# Altium schematic sheet PSU3.SchDoc: PCB-Tester PSU3
size A4; Date: JUN 2020; CheckedBy: Moerz, Hoeren; Author: Rudziński; CompanyName: TDK-Micronas GmbH; DrawnBy: Rudziński; Engineer: Rudziński; Organization: Test Engineering; Address1: Hans-Bunte-Strasse 19; Address2: D-79108 Freiburg; Address3: Germany; DocumentNumber: U33110; Revision: V1.0; SheetNumber: 17; SheetTotal: 20; DateDraw: JUN 2020; DateChecked: 2020-06-19; Workspace: Workspace; TitleTyp: Title-Typ; PageSetup: Record=PageOptions|CenterHorizontal=True|CenterVertical=True|PrintScale=0.97|XCorrection=1.00|YCorrection=1.00|PrintKind=0|BorderSize=5000000|LeftOffset=0|BottomOffset=0|Orientation=2|PaperLength=1000|PaperWidth=1000|Scale=100|PaperSource=7|PrintQuality=-3|MediaType=1|DitherType=10|PrintScaleMode=1|PaperKind=A4|PaperIndex=9
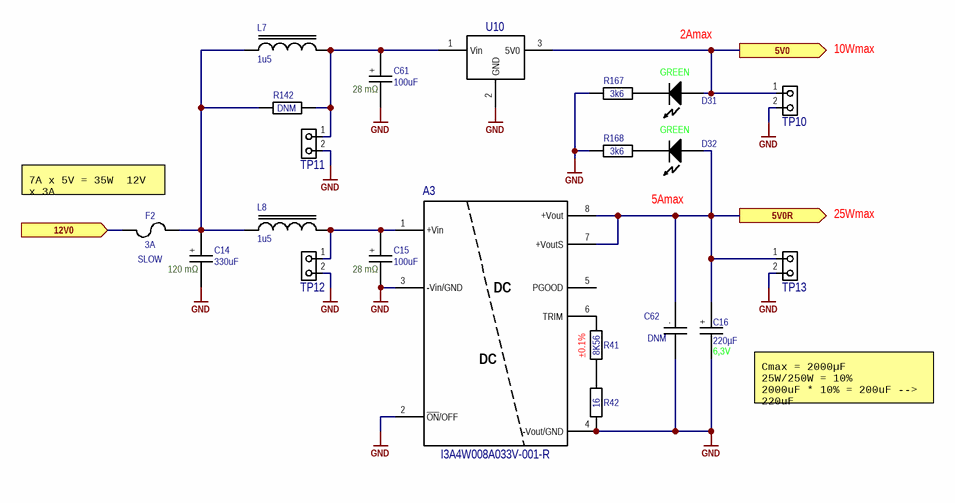
[diagram p0: PSU3.SchDoc]

## Parts
A3  A  [I3A-POSETIVE]  (value not drawn)
C14  value 330uF  ESR: 120 mΩ  [SMD-CAP-ALU-G]  (hidden comment: C+)
C15  value 100uF  ESR: 28 mΩ  [SMD-CAP-ALU-G]  (hidden comment: C+)
C16  value 220µF  Voltage Rating: 6,3V  [SMD-CAP-ALU-E]  (hidden comment: C+)
C61  value 100uF  ESR: 28 mΩ  [SMD-CAP-ALU-G]  (hidden comment: C+)
C62  value DNM  [C0402 Reflow]  (hidden comment: C)  (no BOM)
D31  Color: GREEN  [L0603G]  (hidden comment: D)
D32  Color: GREEN  [L0603G]  (hidden comment: D)
F2  value 3A  Speed: SLOW  [OMNI-Fuse]  (hidden comment: F)
L7  Inductance: 1u5  [XAL4020]  (hidden comment: L)
L8  Inductance: 1u5  [XAL4020]  (hidden comment: L)
R41  value 8K56  Tolerance: ±0.1%  [R0603 Reflow]  (hidden comment: R)
R42  value 16  [R0603 Reflow]  (hidden comment: R)
R142  value DNM  [R1206 Reflow]  (hidden comment: R)  (no BOM)
R167  value 3k6  [R0603 Reflow]  (hidden comment: R)
R168  value 3k6  [R0603 Reflow]  (hidden comment: R)
TP10  TP  [DualTestpoint 100mils]  (value not drawn)  (no BOM)
TP11  TP  [DualTestpoint 100mils]  (value not drawn)  (no BOM)
TP12  TP  [DualTestpoint 100mils]  (value not drawn)  (no BOM)
TP13  TP  [DualTestpoint 100mils]  (value not drawn)  (no BOM)
U10  U  [3SIP Traco]  (value not drawn)

## Ports
5V0 (out), 5V0R (out), 12V0 (in)

## Nets
GND: A3.2(~{ON}/OFF) A3.3(-Vin/GND) A3.4(-Vout/GND) C14.2 C15.2 C16.2 C61.2 C62.2 R42.1 R167.1 R168.1 TP10.2 TP11.2 TP12.2 TP13.2 U10.2(GND)
5V0: D31.1(Anode) TP10.1 U10.3(5V0) ; port 5V0
5V0R: A3.7(+VoutS) A3.8(+Vout) C16.1 C62.1 D32.1(Anode) TP13.1 ; port 5V0R
12V0: F2.1 ; port 12V0
NetA3_1: A3.1(+Vin) C15.1 L8.1 TP12.1
NetA3_6: A3.6(TRIM) R41.2
NetC14_1: C14.1 F2.2 L7.2 L8.2 R142.1
NetC61_1: C61.1 L7.1 R142.2 TP11.1 U10.1(Vin)
NetD31_2: D31.2(Cathode) R167.2
NetD32_2: D32.2(Cathode) R168.2
NetR41_1: R41.1 R42.2

Not connected (* = marked no-connect by the designer): A3 5(PGOOD)

## Notes on the sheet
- 2Amax
- 10Wmax
- (near F2) 7A x 5V = 35W  12V x 3A
- 5Amax
- 25Wmax
- (near C16) Cmax = 2000µF
  25W/250W = 10%
  2000uF * 10% = 200uF --> 220uF
- designed by
- reviewed by
- last drawn by
- Project:
- Schematic:
- last printed
- DIN-A4 L
- sheets
- of
- File:
- (in symbol C) .
- (in symbol C+) +
- (in symbol i3A4W008A033V-001-R) DC

## Library data of the parts
A3 = i3A4W008A033V-001-R: DC DC CONVERTER 3.3-16.5V; 04. Manufacturer: TDK-Lambda Americas Inc.; 03. Unit Price: 20.58; 13. Created Date/Name: AUG 2018 / Hören; 01. Distributor: DigiKey; 02. Distributor Part Number: 285-2720-ND; 07. Manufacturer  Part Number: I3A4W008A033V-001-R; 11. RoHS: YES; ComponentLink1Description: Info; ComponentLink1URL: https://www.digikey.de/products/en?keywords=I3A4W008A033V-001-R; ComponentLink2Description: DataSheet; ComponentLink2URL: https://www.us.tdk-lambda.com/ftp/specs/i3a_full_datasheet.pdf?ref_disty=digikey; NicName: I3A4W008A033V-001-R
C14 = C+: CAP ALUM 330UF 20% 50V SMD; 04. Manufacturer: Panasonic Electronic Components; 07. Manufacturer  Part Number: EEE-FT1H331AP; 03. Unit Price: 0.96; 13. Created Date/Name: AUG2018/Hören; 3D-Export: No; ComponentLink1Description: Info; ComponentLink1URL: https://www.digikey.de/product-detail/en/panasonic-electronic-components/EEE-FT1H331AP/PCE5026DKR-ND/2652105; Tolerance: ±20%; Voltage Rating: 50V; 02. Distributor Part Number: PCE5026DKR-ND; 09. Operating Temperature: -55°C ~ 105°C; 11. RoHS: YES; 01. Distributor: DigiKey; ComponentLink2Description: DataSheet; ComponentLink2URL: https://industrial.panasonic.com/cdbs/www-data/pdf/RDE0000/ABA0000C1240.pdf
C15 C61 = C+: CAP ALUM POLY HYB 100UF 50V SMD; 04. Manufacturer: Panasonic Electronic Components; 07. Manufacturer  Part Number: EEH-ZA1H101P; Tolerance: ±20%; 03. Unit Price: 2.5; 13. Created Date/Name: AUG2018/Hören; 3D-Export: No; ComponentLink1Description: Info; ComponentLink1URL: https://www.digikey.de/product-detail/en/panasonic-electronic-components/EEH-ZA1H101P/P15442DKR-ND/3088152; Voltage Rating: 50V; 02. Distributor Part Number: P15442DKR-ND; 09. Operating Temperature: -55°C ~ 105°C; 11. RoHS: YES; 01. Distributor: DigiKey; ComponentLink2Description: DataSheet; ComponentLink2URL: https://industrial.panasonic.com/cdbs/www-data/pdf/RDD0000/ABA0000C1221.pdf
C16 = C+: CAP ALUM 220UF 20% 6.3V SMD; 04. Manufacturer: Panasonic Electronic Components; 07. Manufacturer  Part Number: EEE-FC0J221P; ESR: 400 mΩ; Type: Radial, Can - SMD; 03. Unit Price: 0.57; 13. Created Date/Name: AUG2018/Hören; Lifetime @ Temp: 1000 Hrs @ 105°C; 3D-Export: No; ComponentLink1Description: Info; ComponentLink1URL: https://www.digikey.de/product-detail/en/panasonic-electronic-components/EEE-FC0J221P/PCE3985DKR-ND/1806511; Tolerance: ±20%; 02. Distributor Part Number: PCE3985DKR-ND; 09. Operating Temperature: -40°C ~ 105°C; 11. RoHS: YES; 01. Distributor: DigiKey; ComponentLink2Description: DataSheet; ComponentLink2URL: https://industrial.panasonic.com/cdbs/www-data/pdf/RDE0000/ABA0000C1172.pdf; Package: Ø8mm x 6.2mm
C62 = C: CAP CER 0.1UF 16V X7R 0402; 04. Manufacturer: KEMET; 07. Manufacturer  Part Number: C0402C104J4RACTU; Tolerance: ±5%; 03. Unit Price: 0.45; 13. Created Date/Name: AUG2018/Hören; Voltage Rating: 16V; Type: X7R; ComponentLink1Description: Info; ComponentLink1URL: https://www.digikey.de/product-detail/en/kemet/C0402C104J4RACTU/399-7761-6-ND/3472292; 02. Distributor Part Number: 399-7761-6-ND; 09. Operating Temperature: -55°C ~ 125°C; 11. RoHS: YES; 01. Distributor: DigiKey; ComponentLink2Description: DataSheet; ComponentLink2URL: https://content.kemet.com/datasheets/KEM_C1002_X7R_SMD.pdf; Package: 0402
D31 D32 = LED: LED GREEN DIFFUSED 0603 SMD; 04. Manufacturer: OSRAM Opto Semiconductors Inc.; 07. Manufacturer  Part Number: LG L29K-G2J1-24-Z; Vf: 1.7V; If: 2mA; Wave Length: 570nm; Viewing Angle: 160°; 03. Unit Price: 0.4; 13. Created Date/Name: AUG2018/Hören; ComponentLink1Description: Info; ComponentLink1URL: https://www.digikey.de/products/en?keywords=475-2709-6-ND; ComponentLink2Description: DataSheet; ComponentLink2URL: https://www.digikey.de/products/en?keywords=475-2709-6-ND; 02. Distributor Part Number: 475-2709-6-ND; 11. RoHS: YES; 01. Distributor: DigiKey
F2 = Fuse: FUSE BOARD MNT 3A 125VAC/VDC SMD; 04. Manufacturer: Littelfuse Inc.; 07. Manufacturer  Part Number: 0154003.DRTL; 03. Unit Price: 2.84; 13. Created Date/Name: AUG 2018 / Hören; 3D-Export: No; 01. Distributor: DigiKey; 02. Distributor Part Number: F10747DKR-ND; 09. Operating Temperature: -55°C ~ 125°C; 11. RoHS: YES; ComponentLink1Description: Info; ComponentLink1URL: https://www.digikey.de/product-detail/en/littelfuse-inc/0154003.DRTL/F10747DKR-ND/8109626; ComponentLink2Description: DataSheet; ComponentLink2URL: https://www.littelfuse.com/~/media/electronics/datasheets/fuses/littelfuse_fuse_154_154t_154l_154tl_datasheet.pdf.pdf
L7 L8 = INDUCTOR: Fixed Inductors 1.5uH Shld 20% 7.5A 23.6mOhms AECQ2; 04. Manufacturer: Coilcraft; 07. Manufacturer  Part Number: XAL4020-152MEC; Impedance Tolerance: %; 03. Unit Price: 1.75; ComponentLink1Description: Info; ComponentLink1URL: https://www.digikey.de/products/en?keywords=732-1620-6-ND; ComponentLink2Description: DataSheet; ComponentLink2URL: https://www.we-online.de/katalog/datasheet/742792040.pdf; 02. Distributor Part Number: 994-XAL4020-152MEC; 11. RoHS: YES; Tolerance: *; Value: *; 01. Distributor: Mouser
R41 = R: RES 8.56K OHM 0.1% 1/8W 0603; 04. Manufacturer: Vishay Dale; 07. Manufacturer  Part Number: TNPW06038K56BEEA; 03. Unit Price: 0.56; 13. Created Date/Name: AUG2018/Hören; Power Rating: 125mW; 3D-Export: No; ComponentLink1URL: https://www.digikey.de/products/en/resistors/chip-resistor-surface-mount/52?k=&pkeyword=&sv=0&pv2085=u8.56+kOhms&pv3=370&sf=0&FV=ffe00034%2C1c00f3%2C1f140000&quantity=&ColumnSort=0&page=1&pageSize=25; ComponentLink1Description: Info; 02. Distributor Part Number: 541-4554-6-ND; 09. Operating Temperature: -55°C ~ 155°C; 11. RoHS: YES; 01. Distributor: DigiKey; ComponentLink2Description: DataSheet; ComponentLink2URL: http://www.vishay.com/docs/28758/tnpw_e3.pdf; Type: Thin Film; Package: 0603
R42 = R: RES SMD 16 OHM 1% 1/10W 0603; 04. Manufacturer: Yageo; 07. Manufacturer  Part Number: RC0603FR-0716RL; 03. Unit Price: 0.09; 13. Created Date/Name: AUG2018/Hören; Power Rating: 100mW; 3D-Export: No; Tolerance: ±1%; ComponentLink1URL: https://www.digikey.de/product-detail/en/yageo/RC0603FR-0716RL/311-16.0HRDKR-ND/732858; ComponentLink1Description: Info; 02. Distributor Part Number: 311-16.0HRDKR-ND; 09. Operating Temperature: -55°C ~ 155°C; 11. RoHS: YES; 01. Distributor: DigiKey; ComponentLink2Description: DataSheet; ComponentLink2URL: http://www.yageo.com/documents/recent/PYu-RC_Group_51_RoHS_L_10.pdf; Type: Thick Film; Package: 0603
R142 = R_25: RES SMD 0 OHM JUMPER 1206; ComponentLink1URL: https://www.digikey.de/products/en?keywords=311-0.0JRDKR-ND; ComponentLink1Description: Info; 11. RoHS: YES; ComponentLink2Description: DataSheet; Package: 1206
R167 R168 = R: RES SMD 3.6K OHM 1% 1/10W 0603; 04. Manufacturer: Yageo; 07. Manufacturer  Part Number: RC0603FR-073K6L; 03. Unit Price: 0.09; 13. Created Date/Name: AUG2018/Hören; Power Rating: 63mW; Tolerance: ±1%; ComponentLink1URL: https://www.digikey.de/product-detail/en/yageo/RC0402FR-071K65L/YAG3043DKR-ND/5282914; ComponentLink1Description: Info; 02. Distributor Part Number: 311-3.60KHRCT-ND; 09. Operating Temperature: -55°C ~ 155°C; 11. RoHS: YES; 01. Distributor: DigiKey; ComponentLink2Description: DataSheet; Type: Thick Film; Package: 0402
TP10-TP13 = DualTestpoint 100mils: Dual testpoint, pitch 2.54mm; 04. Manufacturer: Samtec Inc.; 07. Manufacturer  Part Number: HMTSW-103-07-G-S-240; 03. Unit Price: 0.25; 13. Created Date/Name: AUG2018/Hören; 01. Distributor: Samtec Inc.; 02. Distributor Part Number: HMTSW-103-07-G-S-240; 11. RoHS: YES; ComponentLink1Description: Info; ComponentLink1URL: https://www.samtec.com/products/hmtsw-103-07-g-s-240; ComponentLink2Description: DataSheet; ComponentLink2URL: http://suddendocs.samtec.com/catalog_english/hmtsw.pdf
U10 = TSR 2-2450: DC DC CONVERTER 5V 10W; 04. Manufacturer: Traco Power; 03. Unit Price: 11.31; 13. Created Date/Name: AUG 2018 / Hören; 01. Distributor: DigiKey; 02. Distributor Part Number: 1951-2692-ND; 07. Manufacturer  Part Number: TSR 2-2450; 11. RoHS: YES; ComponentLink1Description: Info; ComponentLink1URL: https://www.digikey.de/products/en/power-supplies-board-mount/dc-dc-converters/922?k=TSR2&k=&pkeyword=TSR2&sv=0&pv1525=249171&sf=0&FV=-8%7C922&quantity=&ColumnSort=0&page=1&pageSize=25; ComponentLink2Description: DataSheet; ComponentLink2URL: https://www.tracopower.com/products/tsr2.pdf; Package: 3SIP